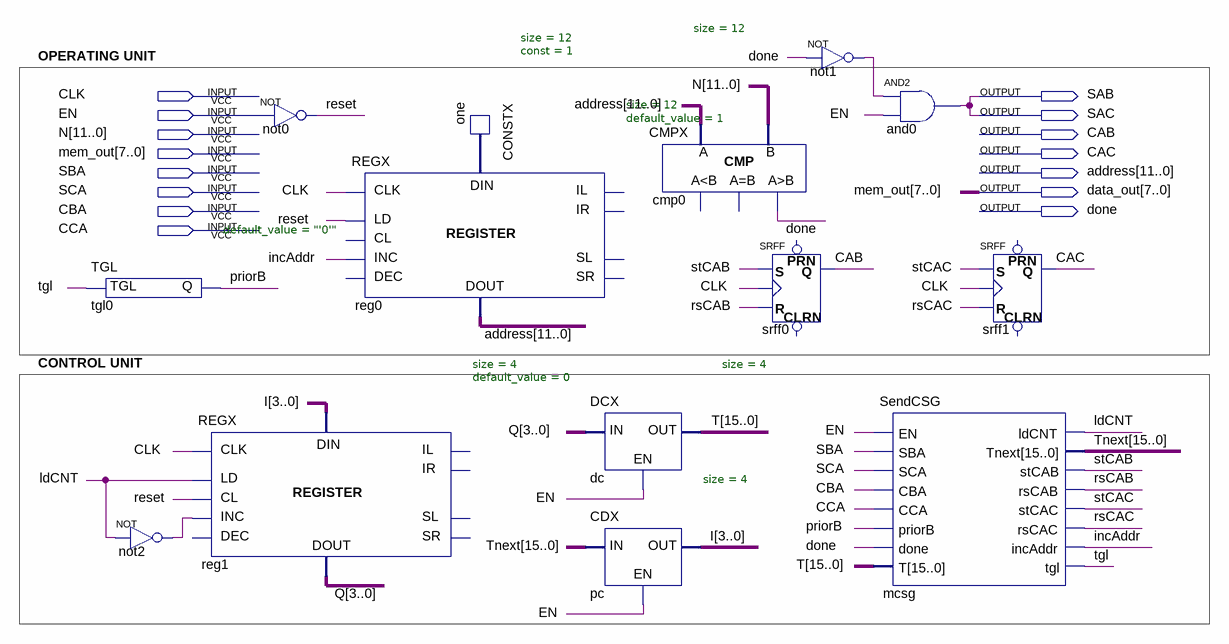
[diagram p0: schematic sheet]
// Quartus schematic Send.bdf as structural Verilog: 14 symbols, 15 pins
module Send (
  input  CLK,
  input  EN,
  input  [11:0] N,
  input  [7:0] mem_out,
  input  SBA,
  input  SCA,
  input  CBA,
  input  CCA,
  output SAB,
  output SAC,
  output CAB,
  output CAC,
  output [11:0] address,
  output [7:0] data_out,
  output done
);

  wire incAddr, ldCNT, not1_out, not2_out, priorB, reset, rsCAB, rsCAC, stCAB, stCAC, tgl;
  wire [3:0] I, Q;
  wire [11:0] one_data;
  wire [15:0] T, Tnext;

  TGL #(.default_value("'0'")) tgl0 (.toggle(tgl), .state(priorB));
  not not2 (not2_out, ldCNT);
  not not0 (reset, EN);
  REGX #(.size(4), .default_value(0)) reg1 (
    .data_in(I), .clk(CLK), .ld(ldCNT), .cl(reset), .inc(not2_out), .data_out(Q));  // open: dec, il, ir, sl, sr
  REGX #(.size(12), .default_value(1)) reg0 (
    .data_in(one_data), .clk(CLK), .ld(reset), .inc(incAddr), .data_out(address));  // open: cl, dec, il, ir, sl, sr
  CONSTX #(.size(12), .\const (1)) one (.data(one_data));
  CMPX #(.size(12)) cmp0 (.A(address), .B(N), .gr(done));  // open: ls, eq
  DCX #(.size(4)) dc (.EN(EN), .X(Q), .Y(T));
  CDX #(.size(4)) pc (.EN(EN), .X(Tnext), .Y(I));
  SRFF srff0 (.S(stCAB), .R(rsCAB), .CLK(CLK), .Q(CAB));  // open: PRN, CLRN
  not not1 (not1_out, done);
  SendCSG mcsg (
    .EN(EN), .SBA(SBA), .SCA(SCA), .CBA(CBA), .CCA(CCA), .priorB(priorB), .done(done), .T(T), .ldCNT(ldCNT),
    .Tnext(Tnext), .stCAB(stCAB), .rsCAB(rsCAB), .stCAC(stCAC), .rsCAC(rsCAC), .incAddr(incAddr), .tgl(tgl));
  and and0 (SAB, not1_out, EN);
  SRFF srff1 (.S(stCAC), .R(rsCAC), .CLK(CLK), .Q(CAC));  // open: PRN, CLRN

  assign data_out = mem_out;
  assign SAC = SAB;

  // Notes on the sheet:
  //   OPERATING UNIT
  //   CONTROL UNIT
endmodule
